# Altium schematic sheet adc.SchDoc
size A4; SheetNumber: 2; SheetTotal: 2
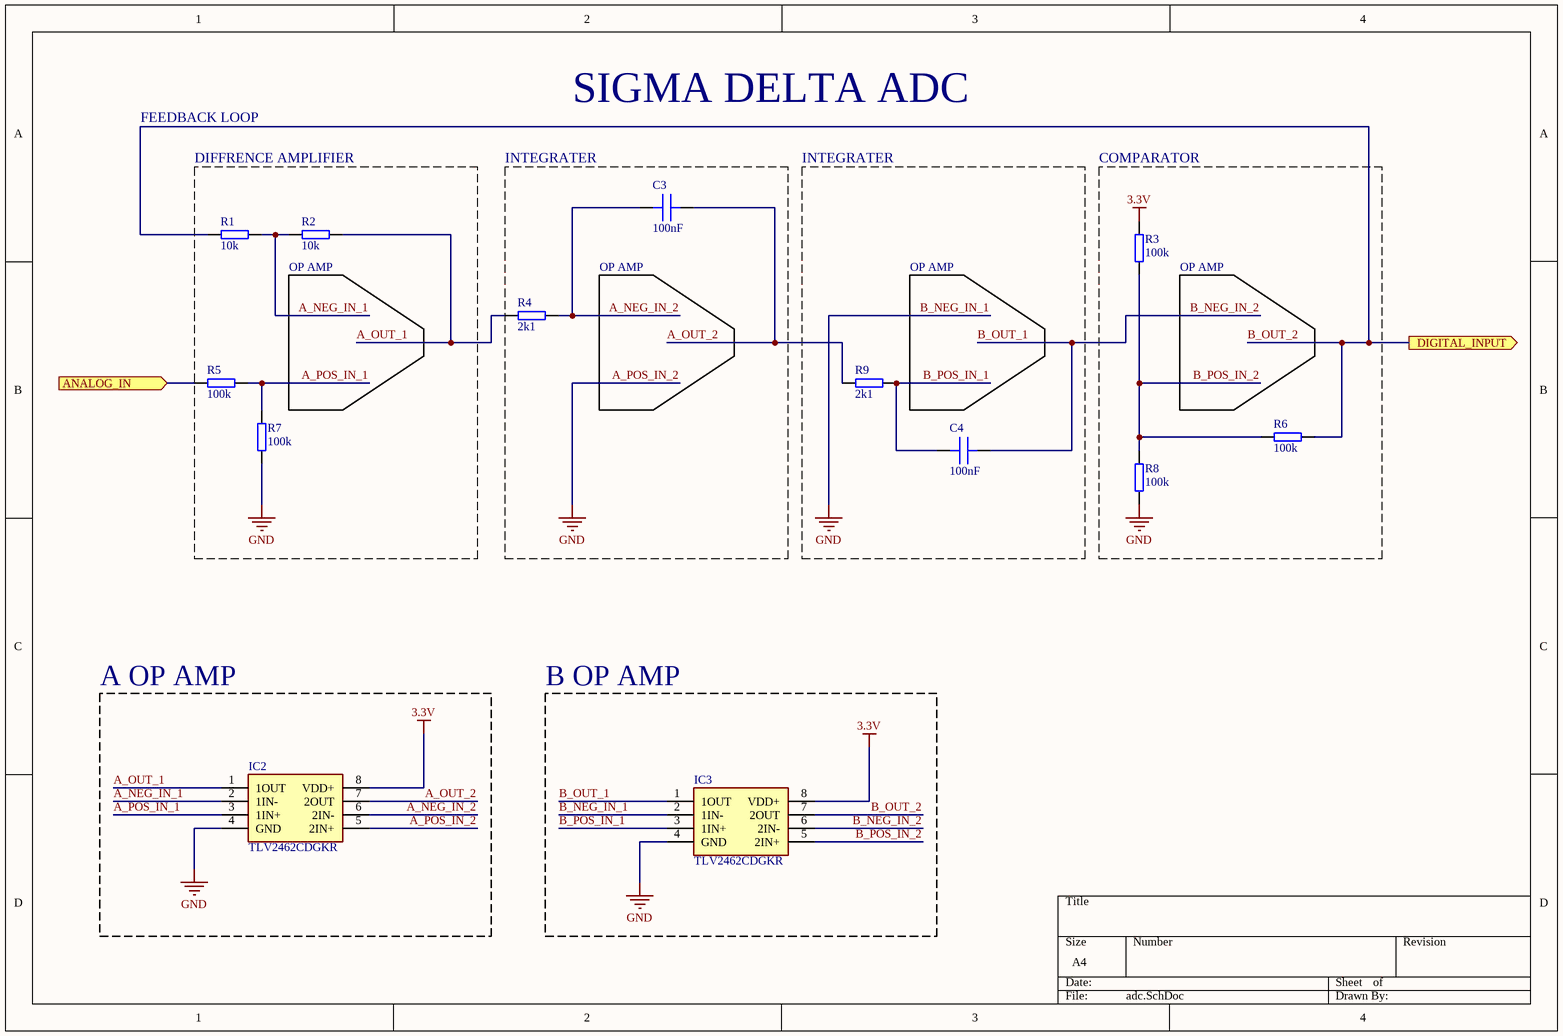
[diagram p0: adc.SchDoc]

## Parts
C3  100nF  [C 0402]
C4  100nF  [C 0402]
IC2  TLV2462CDGKR  [SOP65P490X110-8N]
IC3  TLV2462CDGKR  [SOP65P490X110-8N]
R1  10k  [R 0402]
R2  10k  [R 0402]
R3  100k  [R 0402]
R4  2k1  [R 0402]
R5  100k  [R 0402]
R6  100k  [R 0402]
R7  100k  [R 0402]
R8  100k  [R 0402]
R9  2k1  [R 0402]

## Blocks framed on the sheet
DIFFRENCE AMPLIFIER: R1 R2 R5 R7
INTEGRATER: C3 R4
INTEGRATER: C4 R9
COMPARATOR: R3 R6 R8
A OP AMP: IC2
B OP AMP: IC3

## Ports
ANALOG_IN (in), DIGITAL_INPUT (out)

## Nets
3.3V: IC2.8(VDD+) IC3.8(VDD+) R3.1
A_POS_IN_2: IC2.4(GND) IC2.5(2IN+) IC3.2(1IN-) IC3.4(GND) R7.2 R8.2  [also labelled B_NEG_IN_1, GND]
A_NEG_IN_1: IC2.2(1IN-) R1.1 R2.2
A_NEG_IN_2: C3.2 IC2.6(2IN-) R4.1
A_OUT_1: IC2.1(1OUT) R2.1 R4.2
A_OUT_2: C3.1 IC2.7(2OUT) R9.2
A_POS_IN_1: IC2.3(1IN+) R5.1 R7.1
ANALOG_IN: R5.2 ; port ANALOG_IN
B_NEG_IN_2: C4.1 IC3.1(1OUT) IC3.6(2IN-)  [also labelled B_OUT_1]
B_OUT_2: IC3.7(2OUT) R1.2 R6.2 ; port DIGITAL_INPUT
B_POS_IN_1: C4.2 IC3.3(1IN+) R9.1
B_POS_IN_2: IC3.5(2IN+) R3.2 R6.1 R8.1

## Notes on the sheet
- SIGMA DELTA ADC
- FEEDBACK LOOP
- (near R2) OP AMP
- OP AMP
- (near R3) OP AMP

## Library data of the parts
C3 C4 = Capacitor: MLCC Capacitor
IC2 IC3 = TLV2462CDGKR: Integrated Circuit; Manufacturer_Name: Texas Instruments; Datasheet Link: http://www.ti.com/lit/gpn/TLV2462; Height: 1.1mm; Manufacturer_Part_Number: TLV2462CDGKR; Mouser Part Number: 595-TLV2462CDGKR; Mouser Price/Stock: https://www.mouser.co.uk/ProductDetail/Texas-Instruments/TLV2462CDGKR?qs=Fg5TsMy7H4uE1B0PPHeSQQ%3D%3D; Arrow Part Number: TLV2462CDGKR; Arrow Price/Stock: https://www.arrow.com/en/products/tlv2462cdgkr/texas-instruments?region=nac
R1-R9 = Resistor: General pourpouse resistor